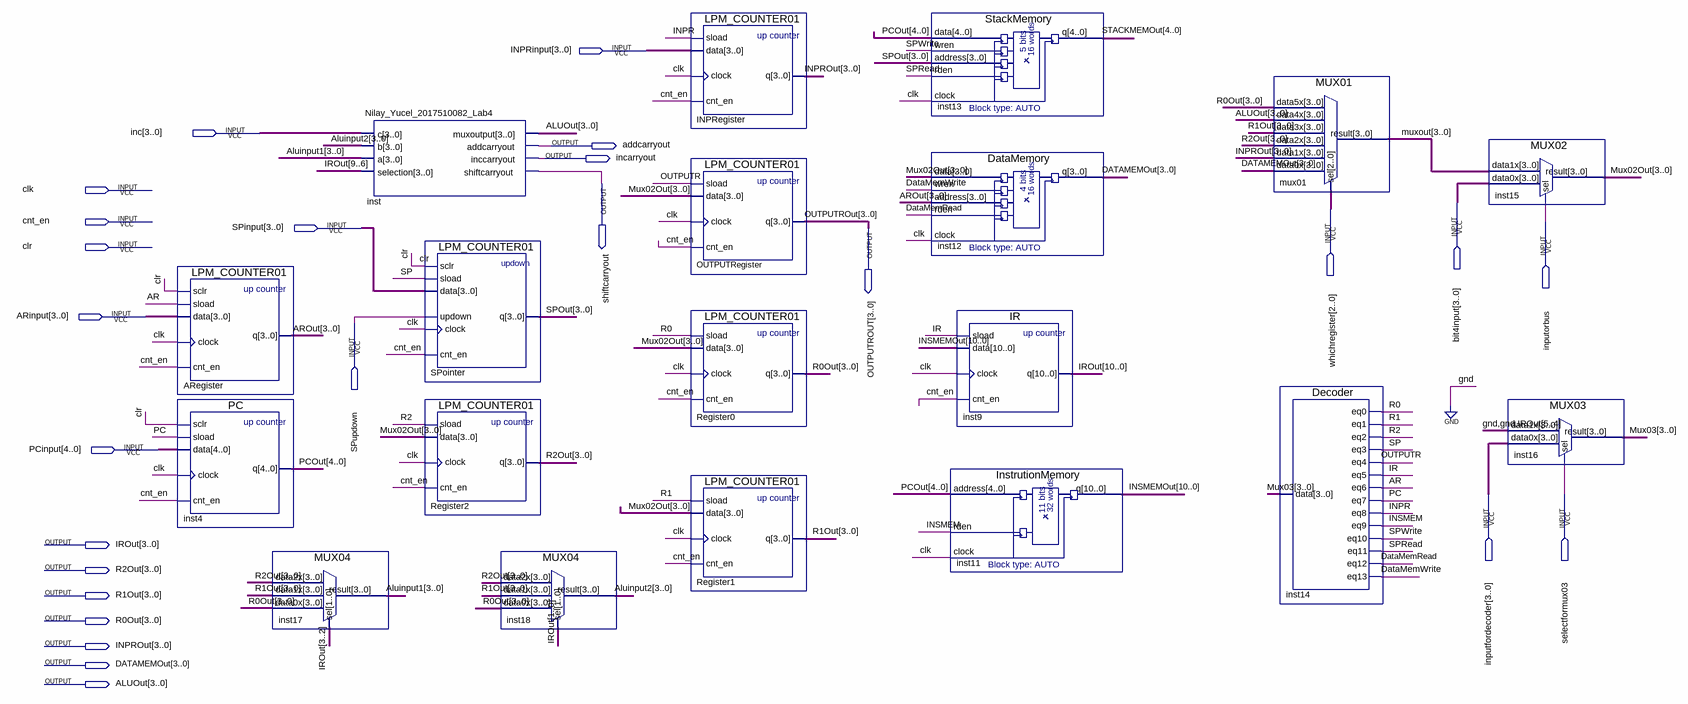
[diagram p0: schematic sheet]
// Quartus schematic BUS_NilayYucel_2017510082.bdf as structural Verilog: 19 symbols, 25 pins
module BUS_NilayYucel_2017510082 (
  input  [3:0] INPRinput,
  input  [3:0] inc,
  input  clk,
  input  [3:0] bit4input,
  input  [2:0] whichregister,
  input  cnt_en,
  input  inputorbus,
  input  [3:0] SPinput,
  input  clr,
  input  [3:0] ARinput,
  input  SPupdown,
  input  [4:0] PCinput,
  input  [3:0] inputfordecoder,
  input  selectformux03,
  output addcarryout,
  output incarryout,
  output shiftcarryout,
  output [3:0] OUTPUTROUT,
  output [10:0] IROut,
  output [3:0] R2Out,
  output [3:0] R1Out,
  output [3:0] R0Out,
  output [3:0] INPROut,
  output [3:0] DATAMEMOut,
  output [3:0] ALUOut
);

  wire AR, DataMemRead, DataMemWrite, INPR, INSMEM, IR, OUTPUTR, PC, R0, R1, R2, SP, SPRead, SPWrite;
  wire [3:0] Aluinput1, Aluinput2, AROut, Mux02Out, Mux03, muxout, SPOut;
  wire [4:0] PCOut, STACKMEMOut;
  wire [10:0] INSMEMOut;

  LPM_COUNTER01 ARegister (.sclr(clr), .sload(AR), .data(ARinput), .clock(clk), .cnt_en(cnt_en), .q(AROut));
  PC inst4 (.sclr(clr), .sload(PC), .data(PCinput), .clock(clk), .cnt_en(cnt_en), .q(PCOut));
  MUX04 inst17 (.data2x(R2Out), .data1x(R1Out), .data0x(R0Out), .sel(IROut[3:2]), .result(Aluinput1));
  Nilay_Yucel_2017510082_Lab4 inst (
    .c(inc), .b(Aluinput2), .a(Aluinput1), .selection(IROut[9:6]), .muxoutput(ALUOut),
    .addcarryout(addcarryout), .inccarryout(incarryout), .shiftcarryout(shiftcarryout));
  LPM_COUNTER01 SPointer (
    .sclr(clr), .sload(SP), .data(SPinput), .updown(SPupdown), .clock(clk), .cnt_en(cnt_en), .q(SPOut));
  LPM_COUNTER01 Register2 (.sload(R2), .data(Mux02Out), .clock(clk), .cnt_en(cnt_en), .q(R2Out));
  MUX04 inst18 (.data2x(R2Out), .data1x(R1Out), .data0x(R0Out), .sel(IROut[1:0]), .result(Aluinput2));
  LPM_COUNTER01 INPRegister (.sload(INPR), .data(INPRinput), .clock(clk), .cnt_en(cnt_en), .q(INPROut));
  LPM_COUNTER01 OUTPUTRegister (.sload(OUTPUTR), .data(Mux02Out), .clock(clk), .cnt_en(cnt_en), .q(OUTPUTROUT));
  LPM_COUNTER01 Register0 (.sload(R0), .data(Mux02Out), .clock(clk), .cnt_en(cnt_en), .q(R0Out));
  LPM_COUNTER01 Register1 (.sload(R1), .data(Mux02Out), .clock(clk), .cnt_en(cnt_en), .q(R1Out));
  StackMemory inst13 (.data(PCOut), .wren(SPWrite), .address(SPOut), .rden(SPRead), .clock(clk), .q(STACKMEMOut));
  DataMemory inst12 (
    .data(Mux02Out), .wren(DataMemWrite), .address(AROut), .rden(DataMemRead), .clock(clk), .q(DATAMEMOut));
  IR inst9 (.sload(IR), .data(INSMEMOut), .clock(clk), .cnt_en(cnt_en), .q(IROut));
  InstrutionMemory inst11 (.address(PCOut), .rden(INSMEM), .clock(clk), .q(INSMEMOut));
  MUX01 mux01 (
    .data5x(R0Out), .data4x(ALUOut), .data3x(R1Out), .data2x(R2Out), .data1x(INPROut), .data0x(DATAMEMOut),
    .sel(whichregister), .result(muxout));
  Decoder inst14 (
    .data(Mux03), .eq0(R0), .eq1(R1), .eq2(R2), .eq3(SP), .eq4(OUTPUTR), .eq5(IR), .eq6(AR), .eq7(PC),
    .eq8(INPR), .eq9(INSMEM), .eq10(SPWrite), .eq11(SPRead), .eq12(DataMemRead), .eq13(DataMemWrite));
  MUX02 inst15 (.data1x(muxout), .data0x(bit4input), .sel(inputorbus), .result(Mux02Out));
  MUX03 inst16 (.data1x({2'b00, IROut[5:4]}), .data0x(inputfordecoder), .sel(selectformux03), .result(Mux03));
endmodule
